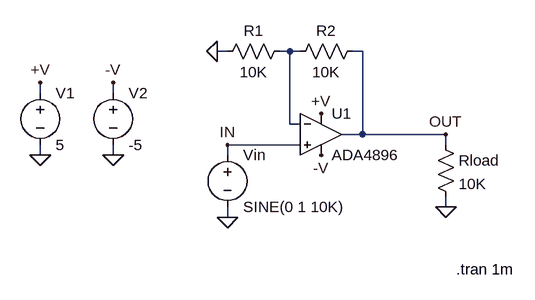
[diagram p0: schematic ADA4896.asc]
ADA4896.asc, the LTspice schematic file:
Version 4
SHEET 1 1240 700
WIRE 432 -1232 416 -1232
WIRE 528 -1232 512 -1232
WIRE 544 -1232 528 -1232
WIRE 640 -1232 624 -1232
WIRE 144 -1168 144 -1184
WIRE 256 -1168 256 -1184
WIRE 528 -1120 528 -1232
WIRE 544 -1120 528 -1120
WIRE 640 -1104 640 -1232
WIRE 640 -1104 608 -1104
WIRE 768 -1104 640 -1104
WIRE 544 -1088 432 -1088
WIRE 768 -1088 768 -1104
WIRE 144 -1072 144 -1088
WIRE 256 -1072 256 -1088
WIRE 432 -1072 432 -1088
WIRE 768 -992 768 -1008
WIRE 432 -976 432 -992
FLAG 144 -1184 +V
FLAG 144 -1072 0
FLAG 432 -976 0
FLAG 768 -1104 OUT
FLAG 432 -1088 IN
FLAG 576 -1136 +V
FLAG 256 -1184 -V
FLAG 576 -1072 -V
FLAG 416 -1232 0
FLAG 768 -992 0
FLAG 256 -1072 0
SYMBOL voltage 144 -1184 R0
WINDOW 123 0 0 Left 2
WINDOW 39 0 0 Left 2
SYMATTR InstName V1
SYMATTR Value 5
SYMBOL voltage 432 -1088 R0
WINDOW 123 24 146 Left 2
WINDOW 39 24 125 Left 2
SYMATTR InstName Vin
SYMATTR Value SINE(0 1 10K)
SYMBOL res 528 -1248 R90
WINDOW 0 0 56 VBottom 2
WINDOW 3 32 56 VTop 2
SYMATTR InstName R1
SYMATTR Value 10K
SYMBOL res 640 -1248 R90
WINDOW 0 0 56 VBottom 2
WINDOW 3 32 56 VTop 2
SYMATTR InstName R2
SYMATTR Value 10K
SYMBOL Opamps\\ADA4896 576 -1168 R0
SYMATTR InstName U1
SYMBOL voltage 256 -1184 R0
WINDOW 123 24 146 Left 2
WINDOW 39 24 125 Left 2
SYMATTR InstName V2
SYMATTR Value -5
SYMBOL res 752 -1104 R0
SYMATTR InstName Rload
SYMATTR Value 10K
TEXT 784 -896 Left 2 !.tran 1m

The netlist it stands for:
* ADA4896.asc
V1 +V 0 5
Vin IN 0 SINE(0 1 10K)
R1 N001 0 10K
R2 OUT N001 10K
XU1 IN N001 +V -V OUT ADA4896  ; pins In+ In- V+ V- OUT
V2 -V 0 -5
Rload OUT 0 10K
.tran 1m
.backanno
.end